# EAGLE design Joy2PS2_mini_v3 (EAGLE 7.6.0)
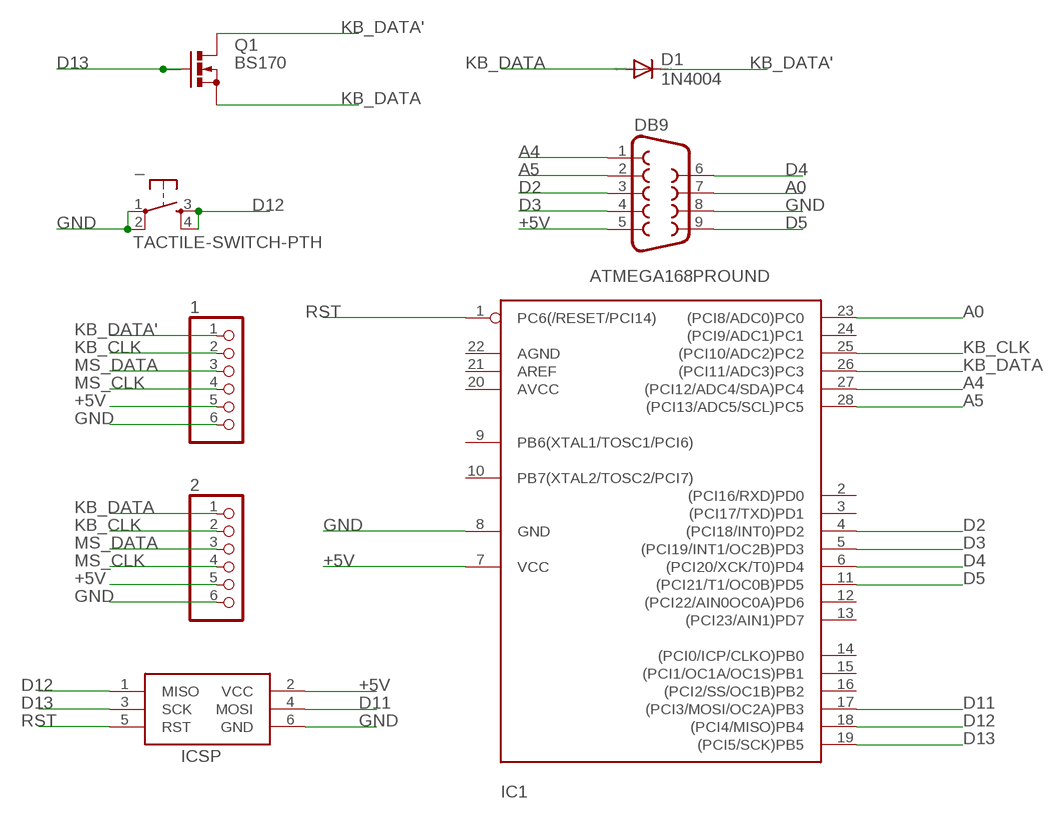
[diagram p0: schematic, sheet 1]

## Parts
1  PINHD-1X6  [1X06]
2  PINHD-1X6  [1X06]
_  TACTILE-SWITCH-PTH  [TAC-SWITCH-PTH]
D1  1N4004  [DO41-10]
DB9  DB9MALE  [DB9_MALE]
IC1  ATMEGA168PROUND  [DIL28-3-ROUND]
ICSP  AVRISP-6  [AVRISP]
Q1  BS170  [SOT54E]

## Nets
+5V: 1.5 2.5 DB9.5 IC1.7(VCC) ICSP.2(VCC)
A0: DB9.7 IC1.23((PCI8/ADC0)PC0)
A4: DB9.1 IC1.27((PCI12/ADC4/SDA)PC4)
A5: DB9.2 IC1.28((PCI13/ADC5/SCL)PC5)
D2: DB9.3 IC1.4((PCI18/INT0)PD2)
D3: DB9.4 IC1.5((PCI19/INT1/OC2B)PD3)
D4: DB9.6 IC1.6((PCI20/XCK/T0)PD4)
D5: DB9.9 IC1.11((PCI21/T1/OC0B)PD5)
D11: IC1.17((PCI3/MOSI/OC2A)PB3) ICSP.4(MOSI)
D12: _.3 _.4 IC1.18((PCI4/MISO)PB4) ICSP.1(MISO)
D13: IC1.19((PCI5/SCK)PB5) ICSP.3(SCK) Q1.G
GND: 1.6 2.6 _.1 _.2 DB9.8 IC1.8(GND) ICSP.6(GND)
KB_CLK: 1.2 2.2 IC1.25((PCI10/ADC2)PC2)
KB_DATA: 2.1 D1.A IC1.26((PCI11/ADC3)PC3) Q1.S
KB_DATA': 1.1 D1.C Q1.D
MS_CLK: 1.4 2.4
MS_DATA: 1.3 2.3
RST: IC1.1(PC6(/RESET/PCI14)) ICSP.5(RST)
Unconnected: IC1.2((PCI16/RXD)PD0) IC1.3((PCI17/TXD)PD1) IC1.9(PB6(XTAL1/TOSC1/PCI6)) IC1.10(PB7(XTAL2/TOSC2/PCI7)) IC1.12((PCI22/AIN0OC0A)PD6) IC1.13((PCI23/AIN1)PD7) IC1.14((PCI0/ICP/CLKO)PB0) IC1.15((PCI1/OC1A/OC1S)PB1) IC1.16((PCI2/SS/OC1B)PB2) IC1.20(AVCC) IC1.21(AREF) IC1.22(AGND) IC1.24((PCI9/ADC1)PC1)

## Library data of the parts
1 2 = pinhead:PINHD-1X6: PIN HEADER
_ = GeekAmmo:TACTILE-SWITCH: Tactile Switch 4 Pins, SPST NO
D1 = diode:1N4004: DIODE general purpose rectifier, 1 A
DB9 = SparkFun-Connectors:DB9: DB9 Connector Standard DB9 (D-Sub 9) serial connector. Can be used for CAN bus as well as RS485 and RS232. Footprint production proven. Spark Fun Electronics SKU : PRT-00429; PROD_ID: CONN-09904
IC1 = adafruit:ATMEGA168*P: MICROCONTROLLER 16 kBytes FLASH 1 kBytes SRAM 512 Bytes EEPROM USART 8-channel 10 bit ADC
ICSP = adafruit:AVRISP: AVR ISP HEADER Standard 6 pin header for AVR programming
Q1 = transistor-small-signal:BS170: N-CHANNEL MOS FET

## Board
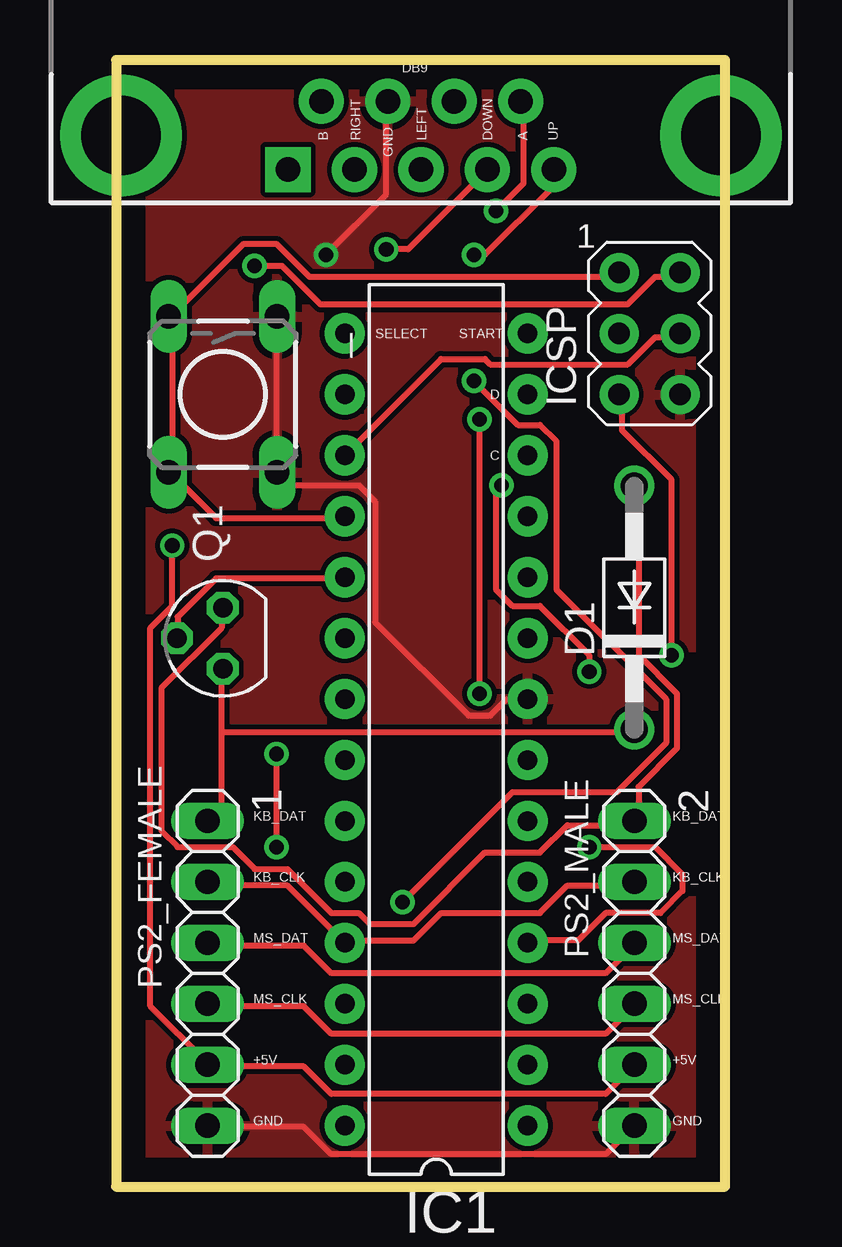
[diagram p1: board, top side]
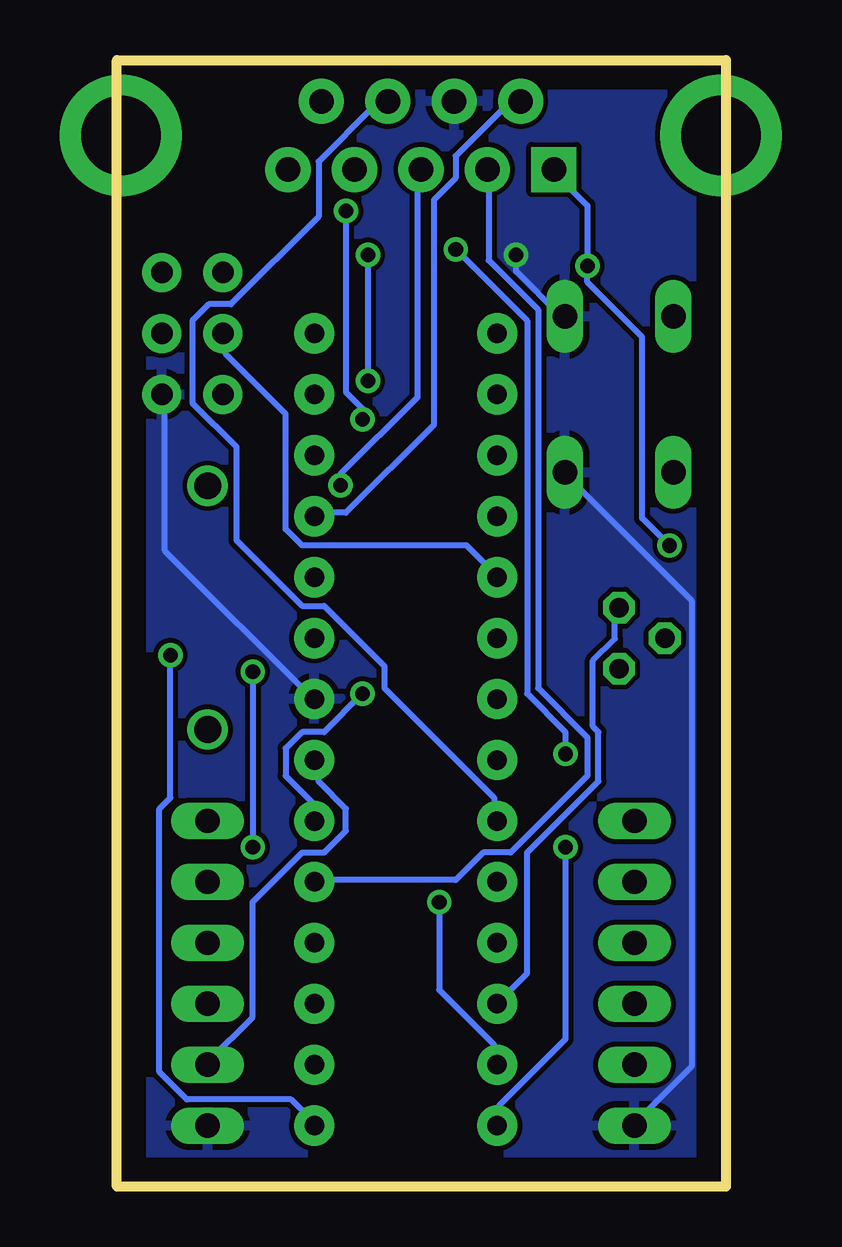
[diagram p2: board, bottom side, seen from below]

Size 25.37 x 46.96 mm. Coordinates in mm from the lower left corner, seen from the top.
Outline: 0,0 25.37,0 25.37,46.96 0,46.96 0,0
Copper layers (1*16): Top 0.035mm / dielectric 1.5mm / Bottom 0.035mm
Design rules "default": minimum track width 10mil, minimum drill 24mil, track to track 8mil, track to pad 8mil, pad to pad 8mil, via to via 8mil, smd to smd 8mil, copper to edge 40mil, drill to drill 8mil, minimum pad ring 10mil, minimum via ring 8mil, stop-mask expansion 4mil, vias tented up to drill 0mil, thermal gap 10mil

### Footprints (pad centres in the part's own frame; a part is rotated, then mirrored left to right if it is on the bottom)
1X06 = drill 1.016 long: 1 -6.35,0; 2 -3.81,0; 3 -1.27,0; 4 1.27,0; 5 3.81,0; 6 6.35,0
TAC-SWITCH-PTH = drill 1.016 pad 1.524 long: 1 -3.251,2.261; 2 3.251,2.261; 3 -3.251,-2.261; 4 3.251,-2.261
DO41-10 = drill 1.118: A 5.08,0; C -5.08,0
DB9_MALE = drill 1.016 pad 1.88: 1 5.54,-1.42; 2 2.77,-1.42; 3 0,-1.42; 4 -2.77,-1.42; 6 4.15,1.42; 7 1.38,1.42; 8 -1.38,1.42; 9 -4.15,1.42 | drill 1.016 pad 1.88 square: 5 -5.54,-1.42 | drill 3.302 pad 5.08: G1 -12.5,0; G2 12.5,0
DIL28-3-ROUND = drill 0.813 pad 1.676: 1 -16.51,-3.81; 2 -13.97,-3.81; 3 -11.43,-3.81; 4 -8.89,-3.81; 5 -6.35,-3.81; 6 -3.81,-3.81; 7 -1.27,-3.81; 8 1.27,-3.81; 9 3.81,-3.81; 10 6.35,-3.81; 11 8.89,-3.81; 12 11.43,-3.81; 13 13.97,-3.81; 14 16.51,-3.81; 15 16.51,3.81; 16 13.97,3.81; 17 11.43,3.81; 18 8.89,3.81; 19 6.35,3.81; 20 3.81,3.81; 21 1.27,3.81; 22 -1.27,3.81; 23 -3.81,3.81; 24 -6.35,3.81; 25 -8.89,3.81; 26 -11.43,3.81; 27 -13.97,3.81; 28 -16.51,3.81
AVRISP = drill 0.9 pad 1.626: 1 -1.27,2.54; 2 1.27,2.54; 3 -1.27,0; 4 1.27,0; 5 -1.27,-2.54; 6 1.27,-2.54
SOT54E = drill 0.813 octagon: D -1.27,0; G 0,1.905; S 1.27,0

### Placement (x,y rotation side)
1  3.81,8.89 270 top
2  21.59,8.89 270 top
_  4.45,33.02 270 top
D1  21.59,24.13 90 top
DB9  12.7,43.81 0 top
IC1  13.34,19.05 90 top
ICSP  22.23,35.56 0 top
Q1  4.45,22.86 90 top

### Tracks (layer width: path | path; a pad name or v marks a point on that pad's centre or on a via)
+5V  (via drill 0.61)
  Top 0.254: 21.77,5.23 2.5 21.54,5 20.4,3.86 8.97,3.86 7.82,5 3.94,5 1.5 3.71,5.23 1.42,7.52 1.42,23.29 2.34,24.21 v2.34,26.72 | v5.77,38.38 6.91,38.38 8.51,36.78 21.31,36.78 22.45,37.92 23.37,37.92 ICSP.2
  Bottom 0.254: DB9.5 7.14,42.27 5.77,40.89 v5.77,38.38 5.77,37.69 3.48,35.41 3.48,27.86 v2.34,26.72 | IC1.7 16.97,17.58 16.97,16.89 15.82,15.75 15.82,14.83 16.74,13.92 17.65,13.92 19.71,11.86 19.71,7.06 21.54,5.23 2.5
A0
  Bottom 0.254: IC1.23 9.65,15.29 9.65,16.2 14.22,20.78 14.22,21.69 16.74,24.21 17.65,24.21 20.4,26.95 20.4,30.84 22.23,32.66 22.23,36.09 21.54,36.78 20.62,36.78 16.97,40.44 16.97,42.72 14.68,45.01 14.22,45.01 DB9.7
A4  (via drill 0.61)
  Top 0.254: v11.94,11.86 16.51,16.43 20.85,16.43 22.91,18.49 22.91,20.32 18.34,24.89 18.34,31.06 17.65,31.75 16.74,31.75 v14.91,33.58 | v14.91,38.84 15.37,38.84 18.11,41.58 18.11,42.27 DB9.1
  Bottom 0.254: v11.94,11.86 11.94,8.2 9.65,5.92 9.65,5.23 IC1.27 | v14.91,38.84 v14.91,33.58
A5  (via drill 0.61)
  Top 0.254: v6.68,18.03 v6.68,14.15 | v11.25,39.06 12.17,39.06 15.37,42.27 DB9.2
  Bottom 0.254: v6.68,14.15 6.68,6.15 9.42,3.4 9.42,2.72 IC1.28 | v6.68,18.03 6.68,18.95 8.28,20.55 8.28,36.09 v11.25,39.06
D2  (via drill 0.61)
  Top 0.254: v19.71,14.15 22.45,14.15 23.6,13.01 23.6,12.32 22.68,11.4 20.4,11.4 19.25,10.26 17.2,10.26 IC1.4 | v19.71,21.46 19.71,22.15 17.65,24.21 16.51,24.21 15.82,24.89 15.82,29.01 v16.05,29.23
  Bottom 0.254: v19.71,21.46 v19.71,14.15 | v16.05,29.23 16.05,29.69 12.85,32.89 12.85,42.27 DB9.3
D3
  Bottom 0.254: IC1.5 16.97,12.78 11.25,12.78 10.11,13.92 8.97,13.92 5.77,17.12 5.77,18.72 7.82,20.78 7.82,36.55 9.88,38.61 9.88,42.27 DB9.4
D4  (via drill 0.61)
  Top 0.254: v15.14,31.98 v15.14,20.55 | v15.82,40.66 16.97,41.81 16.97,45.01 DB9.6
  Bottom 0.254: v15.14,20.55 16.74,18.95 17.65,18.95 18.34,18.26 18.34,17.12 17.2,15.98 17.2,15.29 IC1.6 | v15.14,31.98 15.14,32.44 15.82,33.12 v15.82,40.66
D5
  Bottom 0.254: IC1.11 16.97,28.09 15.82,28.09 12.17,31.75 12.17,41.12 11.25,42.04 11.25,42.95 9.2,45.01 8.74,45.01 DB9.9
D11
  Top 0.254: IC1.17 13.54,34.49 15.37,34.49 15.6,34.27 21.31,34.27 22.45,35.41 23.37,35.41 ICSP.4
D12
  Top 0.254: ICSP.1 20.85,37.92 8.05,37.92 6.68,39.29 5.31,39.29 2.34,36.32 _.3 2.34,36.09 2.34,29.92 _.4 2.34,29.69 4.17,27.86 9.42,27.86 IC1.18
D13
  Top 0.254: Q1.G 2.56,23.06 2.56,23.75 4.17,25.35 9.42,25.35 IC1.19
  Bottom 0.254: ICSP.3 20.85,35.41 20.85,34.72 18.34,32.21 18.34,27.41 17.65,26.72 10.79,26.72 9.65,25.58 IC1.19
GND  (via drill 0.61)
  Top 0.254: 2.6 20.4,1.35 8.97,1.35 7.82,2.49 3.94,2.49 1.6 | _.1 6.68,36.09 6.68,29.92 _.2 6.91,29.69 7.37,29.23 10.11,29.23 10.79,28.55 10.79,23.52 14.68,19.63 15.6,19.63 16.28,20.32 IC1.8 | v8.74,38.84 11.25,41.35 11.25,45.01 DB9.8
  Bottom 0.254: ICSP.6 23.37,32.89 23.37,26.49 17.2,20.32 IC1.8 | v8.74,38.84 8.74,38.15 6.91,36.32 _.1 | 1.6 3.71,2.72 1.42,5 1.42,24.44 6.68,29.69 _.2
  pour Bottom: 0,46.99 25.4,46.99 25.4,0 0,0
  pour Top: 0,46.99 25.4,46.99 25.4,0 0,0
KB_CLK
  Top 0.254: 1.2 3.94,12.55 7.14,12.55 IC1.25 9.65,10.26 12.39,10.26 13.54,11.4 17.65,11.4 18.8,12.55 21.54,12.55 2.2
KB_DATA
  Top 0.254: D1.A 21.77,29.01 21.77,22.15 23.37,20.55 23.37,18.26 21.77,16.66 21.77,15.29 2.1 21.54,15.06 18.8,15.06 17.65,13.92 15.37,13.92 12.39,10.95 10.57,10.95 10.11,11.4 8.97,11.4 7.14,13.23 5.77,13.23 4.85,14.15 2.56,14.15 1.88,14.83 1.88,20.78 4.39,23.29 4.39,23.98 Q1.S
  Bottom 0.254: 21.77,29.01 D1.A | Q1.S 4.62,23.98 4.62,22.84 5.54,21.92 5.54,19.18 5.31,18.95 5.31,16.89 8.28,13.92 8.28,8.89 9.42,7.75 IC1.26
KB_DATA'
  Top 0.254: 4.39,18.95 4.39,15.75 3.94,15.29 1.1 | 4.39,18.95 4.39,21.46 Q1.D | 4.39,18.95 21.54,18.95 D1.C
MS_CLK
  Top 0.254: 1.4 3.94,7.52 7.82,7.52 8.97,6.37 20.4,6.37 21.54,7.52 2.4
MS_DATA
  Top 0.254: 1.3 3.94,10.03 7.82,10.03 8.97,8.89 20.4,8.89 21.54,10.03 2.3
RST  (via drill 0.61)
  Top 0.254: v23.14,22.15 23.14,29.46 21.08,31.52 21.08,32.89 ICSP.5
  Bottom 0.254: v23.14,22.15 23.14,16.2 23.6,15.75 23.6,4.78 22.45,3.63 18.11,3.63 17.2,2.72 IC1.1

### Text on the board
tPlace: B | RIGHT | LEFT | DOWN | A | UP | GND | SELECT | START | D | C | KB_DAT | KB_DAT | KB_CLK | KB_CLK | MS_DAT | MS_DAT | PS2_MALE | PS2_FEMALE | MS_CLK | MS_CLK | +5V | +5V | GND | GND